# EAGLE design QL_keyboard (EAGLE 7.5.0)
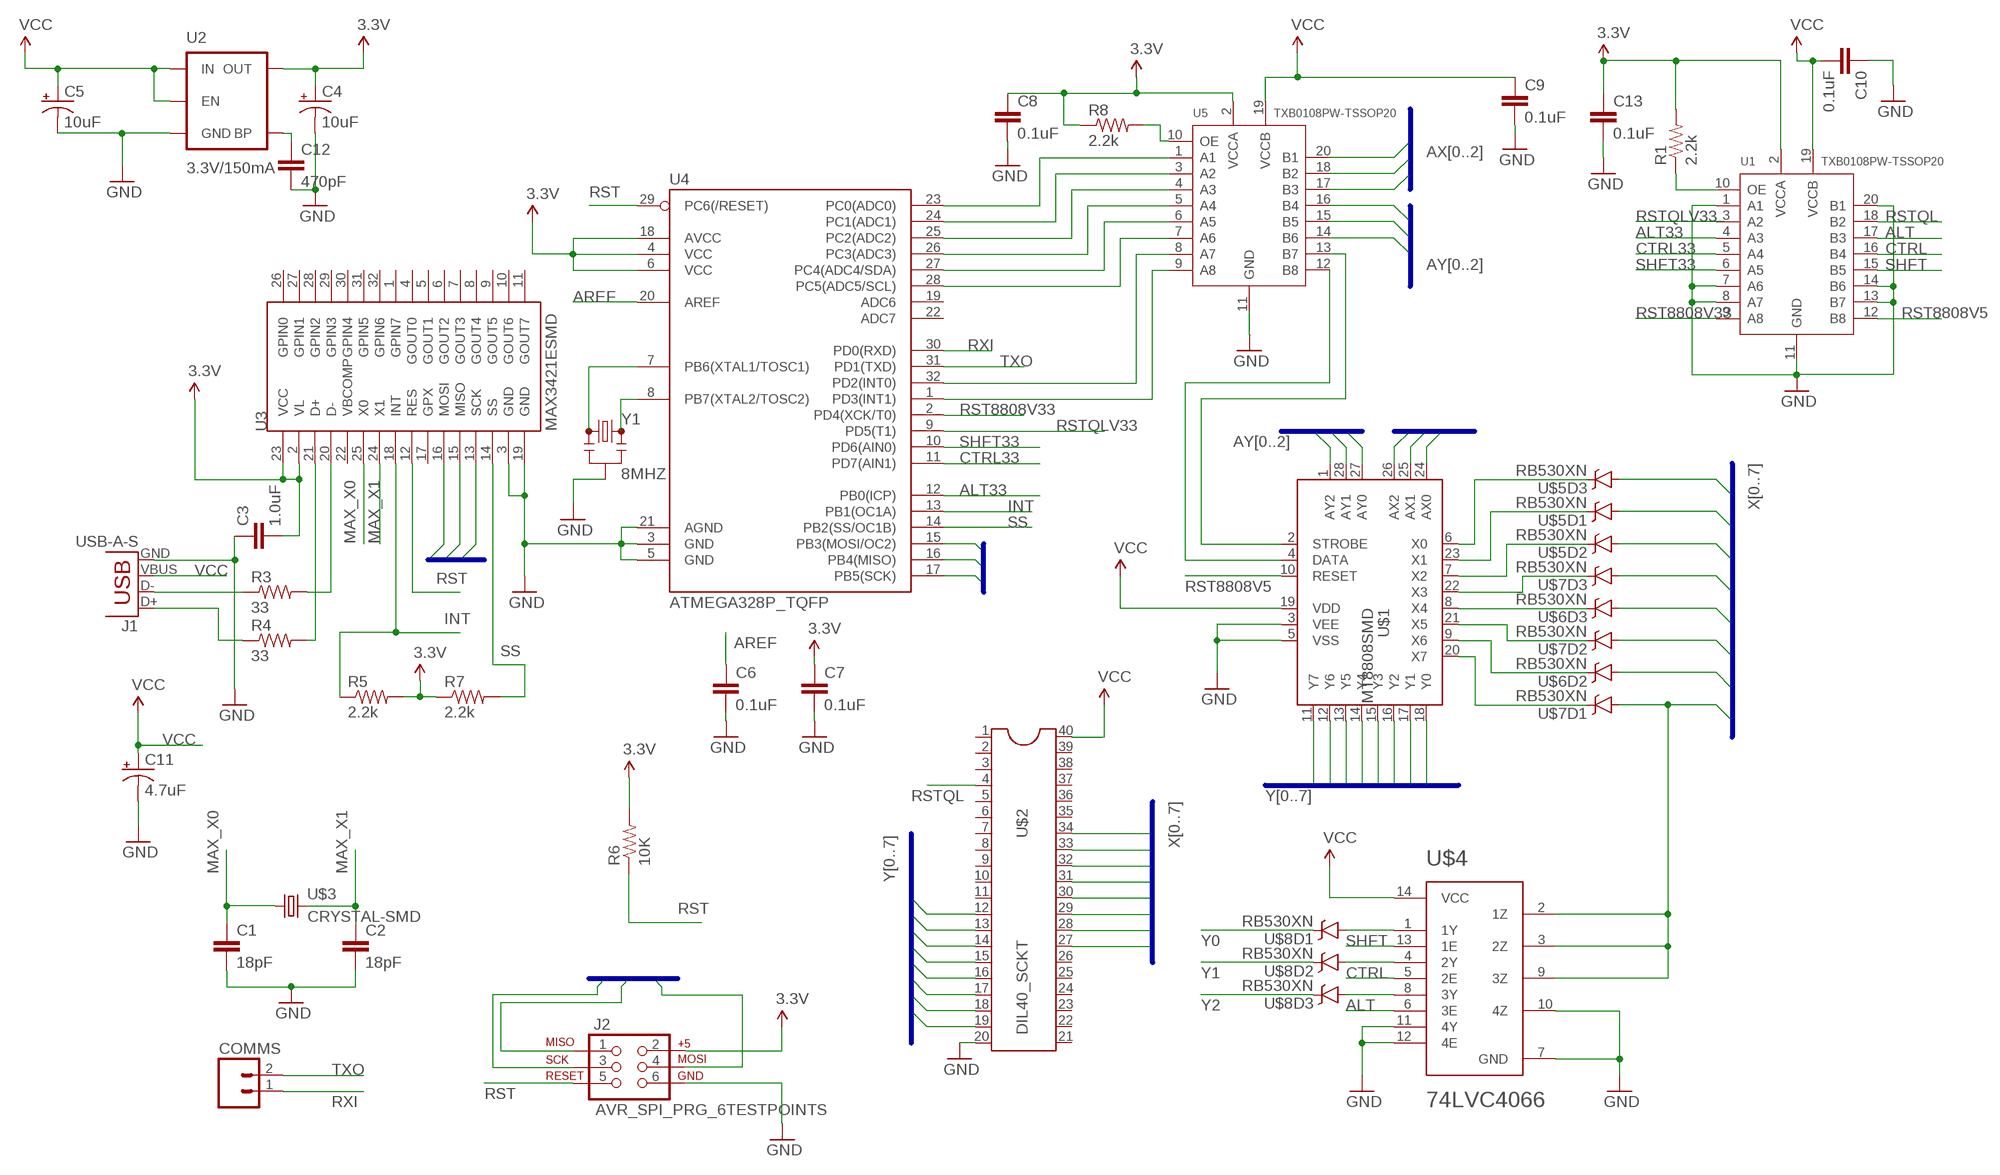
[diagram p0: schematic, sheet 1]

## Parts
C1  18pF  CAP0603-CAP  [0603-CAP]
C2  18pF  CAP0603-CAP  [0603-CAP]
C3  1.0uF  1.0UF-16V-10%(0603)  [0603-CAP]
C4  10uF  10UF-16V-10%(TANT)  [EIA3216]
C5  10uF  10UF-16V-10%(TANT)  [EIA3216]
C6  0.1uF  2.2UF-10V-20%(0603)  [0603-CAP]
C7  0.1uF  2.2UF-10V-20%(0603)  [0603-CAP]
C8  0.1uF  2.2UF-10V-20%(0603)  [0603-CAP]
C9  0.1uF  2.2UF-10V-20%(0603)  [0603-CAP]
C10  0.1uF  2.2UF-10V-20%(0603)  [0603-CAP]
C11  4.7uF  10UF-6.3V-20%(0603)(TANT)"  [0603-POL]
C12  470pF  2.2UF-10V-20%(0603)  [0603-CAP]
C13  0.1uF  2.2UF-10V-20%(0603)  [0603-CAP]
COMMS  M02PTH  [1X02]
J1  USB-A-S  [USB-A-S]
J2  AVR_SPI_PRG_6TESTPOINTS  [2X3_TEST_POINTS]
R1  2.2k  2.2KOHM-1/10W-1%(0603)  [0603-RES]
R3  33  33OHM1/10W1%(0603)  [0603-RES]
R4  33  33OHM1/10W1%(0603)  [0603-RES]
R5  2.2k  2.2KOHM-1/10W-1%(0603)  [0603-RES]
R6  10K  10KOHM-1/10W-1%(0603)0603  [0603-RES]
R7  2.2k  2.2KOHM-1/10W-1%(0603)  [0603-RES]
R8  2.2k  2.2KOHM-1/10W-1%(0603)  [0603-RES]
U1  TXB0108PW-TSSOP20  LOGIC-TXB0108PW(TSSOP20)  [TSSOP20-0.65-6.5X4.4MM]
U2  3.3V/150mA  V_REG_MIC52053.3V  [SOT23-5]
U3  MAX3421ESMD  [TQFP32-5MM]
U4  ATMEGA328P_TQFP  [TQFP32-08]
U5  TXB0108PW-TSSOP20  LOGIC-TXB0108PW(TSSOP20)  [TSSOP20-0.65-6.5X4.4MM]
U$1  MT8808SMD  [PLCC28S]
U$2  DIL40_SCKT  [DIL40]
U$3  CRYSTAL-SMD  [CRYSTAL-SMD-5X3.2]
U$4  74LVC4066  [TSSOP14]
U$5  RB530XN  [SOT363]
U$6  RB530XN  [SOT363]
U$7  RB530XN  [SOT363]
U$8  RB530XN  [SOT363]
Y1  8MHZ  RESONATOR8MHZ  [RESONATOR-SMD]

## Nets
3.3V: C3.2 C4.A(+) C7.1 C8.1 C13.1 J2.2 R1.2 R5.2 R6.2 R7.1 R8.1 U1.2(VCCA) U2.5(OUT) U3.2(VL) U3.23(VCC) U4.4(VCC) U4.6(VCC) U4.18(AVCC) U5.2(VCCA)
ALT: U1.17(B3) U$4.6(3E)
ALT33: U1.4(A3) U4.12(PB0(ICP))
AREF: C6.1 U4.20(AREF)
AX0: U5.20(B1) U$1.24(AX0)
AX1: U5.18(B2) U$1.25(AX1)
AX2: U5.17(B3) U$1.26(AX2)
AY0: U5.16(B4) U$1.27(AY0)
AY1: U5.15(B5) U$1.28(AY1)
AY2: U5.14(B6) U$1.1(AY2)
CTRL: U1.16(B4) U$4.5(2E)
CTRL33: U1.5(A4) U4.11(PD7(AIN1))
GND: C1.2 C2.2 C3.1 C4.C(-) C5.C(-) C6.2 C7.2 C8.2 C9.2 C10.1 C11.K(-) C12.2 C13.2 J1.GND J2.6 U1.1(A1) U1.7(A6) U1.8(A7) U1.11(GND) U1.13(B7) U1.14(B6) U1.20(B1) U2.2(GND) U3.3(GND) U3.19(GND) U4.3(GND) U4.5(GND) U4.21(AGND) U5.11(GND) U$1.3(VEE) U$1.5(VSS) U$2.20 U$4.7(GND) U$4.10(4Z) U$4.11(4Y) U$4.12(4E) Y1.2
INT: R5.1 U3.18(INT) U4.13(PB1(OC1A))
MAX_X0: C1.1 U3.25(X0) U$3.1
MAX_X1: C2.1 U3.24(X1) U$3.2
MISO: J2.1 U3.15(MISO) U4.16(PB4(MISO))
MOSI: J2.4 U3.16(MOSI) U4.15(PB3(MOSI/OC2))
N$1: J1.D- R3.1
N$2: R3.2 U3.20(D-)
N$3: R4.2 U3.21(D+)
N$4: J1.D+ R4.1
N$5: C12.1 U2.4(BP)
N$6: U4.23(PC0(ADC0)) U5.1(A1)
N$7: U4.24(PC1(ADC1)) U5.3(A2)
N$8: U4.25(PC2(ADC2)) U5.4(A3)
N$9: U4.26(PC3(ADC3)) U5.5(A4)
N$10: U4.27(PC4(ADC4/SDA)) U5.6(A5)
N$11: U4.28(PC5(ADC5/SCL)) U5.7(A6)
N$12: U4.32(PD2(INT0)) U5.8(A7)
N$13: U5.12(B8) U$1.4(DATA)
N$14: U5.13(B7) U$1.2(STROBE)
N$15: U4.8(PB7(XTAL2/TOSC2)) Y1.3
N$16: U4.7(PB6(XTAL1/TOSC1)) Y1.1
N$17: R8.2 U5.10(OE)
N$18: U4.1(PD3(INT1)) U5.9(A8)
N$19: U$1.6(X0) U$5.3(D3:C)
N$20: U$1.23(X1) U$5.1(D1:C)
N$21: U$1.7(X2) U$5.2(D2:C)
N$22: U$1.22(X3) U$7.3(D3:C)
N$23: U$1.8(X4) U$6.3(D3:C)
N$24: U$1.21(X5) U$7.2(D2:C)
N$25: U$1.9(X6) U$6.2(D2:C)
N$26: U$1.20(X7) U$7.1(D1:C)
N$27: U$4.1(1Y) U$8.6(D1:A)
N$28: U$4.4(2Y) U$8.5(D2:A)
N$29: U$4.8(3Y) U$8.4(D3:A)
N$31: R1.1 U1.10(OE)
RST: J2.5 R6.1 U3.12(RES) U4.29(PC6(/RESET))
RST8808V5: U1.12(B8) U$1.10(RESET)
RST8808V33: U1.9(A8) U4.2(PD4(XCK/T0))
RSTQL: U1.18(B2) U$2.4
RSTQLV33: U4.9(PD5(T1))
RXI: COMMS.1 U4.30(PD0(RXD))
SCK: J2.3 U3.13(SCK) U4.17(PB5(SCK))
SHFT: U1.15(B5) U$4.13(1E)
SHFT33: U1.6(A5) U4.10(PD6(AIN0))
SS: R7.2 U3.14(SS) U4.14(PB2(SS/OC1B))
TXO: COMMS.2 U4.31(PD1(TXD))
VCC: C5.A(+) C9.1 C10.2 C11.A(+) J1.VBUS U1.19(VCCB) U2.1(IN) U2.3(EN) U5.19(VCCB) U$1.19(VDD) U$2.40 U$4.14(VCC)
X0: U$2.27 U$5.4(D3:A)
X1: U$2.28 U$5.6(D1:A)
X2: U$2.29 U$5.5(D2:A)
X3: U$2.30 U$7.4(D3:A)
X4: U$2.31 U$6.4(D3:A)
X5: U$2.32 U$7.5(D2:A)
X6: U$2.33 U$6.5(D2:A)
X7: U$2.34 U$4.2(1Z) U$4.3(2Z) U$4.9(3Z) U$7.6(D1:A)
Y0: U$1.18(Y0) U$2.12 U$8.1(D1:C)
Y1: U$1.17(Y1) U$2.13 U$8.2(D2:C)
Y2: U$1.16(Y2) U$2.14 U$8.3(D3:C)
Y3: U$1.15(Y3) U$2.15
Y4: U$1.14(Y4) U$2.16
Y5: U$1.13(Y5) U$2.17
Y6: U$1.12(Y6) U$2.18
Y7: U$1.11(Y7) U$2.19
Unconnected: U1.3(A2) U3.1(GPIN7) U3.4(GOUT0) U3.5(GOUT1) U3.6(GOUT2) U3.7(GOUT3) U3.8(GOUT4) U3.9(GOUT5) U3.10(GOUT6) U3.11(GOUT7) U3.17(GPX) U3.22(VBCOMP) U3.26(GPIN0) U3.27(GPIN1) U3.28(GPIN2) U3.29(GPIN3) U3.30(GPIN4) U3.31(GPIN5) U3.32(GPIN6) U4.19(ADC6) U4.22(ADC7) U$2.1 U$2.2 U$2.3 U$2.5 U$2.6 U$2.7 U$2.8 U$2.9 U$2.10 U$2.11 U$2.21 U$2.22 U$2.23 U$2.24 U$2.25 U$2.26 U$2.35 U$2.36 U$2.37 U$2.38 U$2.39 U$6.1(D1:C) U$6.6(D1:A)

## Buses
Y[0..7]
X[0..7]
AX[0..2]
AY[0..2]
MOSI,MISO,SCK

## Library data of the parts
C1 C2 = SparkFun-Passives:CAP: Capacitor Standard 0603 ceramic capacitor, and 0.1" leaded capacitor.
C3 = SparkFun-Capacitors:1.0UF-16V-10%(0603): CAP-00868; PROD_ID: CAP-00868
C4 C5 = SparkFun-Capacitors:10UF-16V-10%(TANT): CAP-00811 1206/EIA-3216 Tantalum capacitor; PROD_ID: CAP-00811
C6-C10 C12 C13 = SparkFun-Capacitors:2.2UF-10V-20%(0603): CAP-07888; PROD_ID: CAP-07888; VALUE: 2.2uF
C11 = SparkFun-Capacitors:10UF-6.3V-20%(0603)(TANT); PROD_ID: CAP-13210; VALUE: 10uF
COMMS = ppe_custom:M02: Standard 2-pin 0.1" header. Use with - straight break away headers ( PRT-00116) - right angle break away headers (PRT-00553) - swiss pins (PRT-00743) - machine pins (PRT-00117) - female headers (PRT-00115) Molex polarized connector foot print use with: PRT-08233 with associated crimp pins and housings. 2.54_SCREWTERM for use with PRT-10571. 3.5mm Screw Terminal footprints for PRT-08084 5mm Screw Terminal footprints for use with PRT-08432
J1 = ppe_custom:USB: USB Connectors USB-B-PTH is fully proven SKU : PRT-00139/CONN-08278 USB-miniB is fully proven SKU : PRT-00587 USB-A-PCB is untested. USB-A-H is throughly reviewed, but untested. Spark Fun Electronics SKU : PRT-00437 USB-B-SMT is throughly reviewed, but untested. Needs silkscreen touching up. USB-A-S has not been used/tested USB-MB-H has not been used/tested USB-MICROB has been used. CONN-09505
J2 = SparkFun-Connectors:AVR_SPI_PRG_6: AVR ISP 6 Pin This is the reduced ISP connector for AVR programming. Common on Arduino. This footprint will take up less PCB space and can be used with a 10-pin to 6-pin adapter such as SKU: BOB-08508 **Special note about "TEST_POINT" package. The stop mask is on the top side, so if you want your programming test points to be on the bottom of your board, make sure to place this package on the bottom side of the board. This also ensure that the orientation to program from the bottom side will be correct.
R1 R5 R7 R8 = SparkFun-Resistors:2.2KOHM-1/10W-1%(0603): RES-08272; PROD_ID: RES-08272
R3 R4 = SparkFun-Resistors:33OHM1/10W1%(0603): RES-08270; PROD_ID: RES-08270
R6 = SparkFun-Resistors:10KOHM-1/10W-1%(0603): RES-00824; PROD_ID: RES-00824
U1 U5 = Seeed-OPL-ic:LOGIC-TXB0108PW(TSSOP20): 310050024; MPN: TXB0108PW
U2 = SparkFun-PowerIC:V_REG_MIC5205: V_REG MIC5205 Standard 3.3V, 5V, and Adjustable 150mA LDO voltage regulator in SOT-23 layout. Micrel part MIC5205. BP (by-pass) pin is used to lower output noise with 470pF cap, may be left open. On the adjustable version BP is used to set output.; PROD_ID: VREG-00822
U3 = SparkFun-DigitalIC:MAX3421E: USB Peripheral/Host Controller w/ SPI
U4 = SparkFun-DigitalIC:ATMEGA328P_TQFP; PROD_ID: IC-09069
U$1 = ppe_custom:MT8808
U$2 = ppe_custom:DIL40_SCKT
U$3 = ppe_custom:CRYSTAL-SMD: CTS Model 445 SMD Quartz DS http://www.mouser.com/ds/2/96/008-0360-0-786290.pdf
U$4 = ppe_custom:74LVC4066: Quad bilateral switch - The 74LVC4066 provides four single pole, single-throw analog switch functions.
U$5-U$8 = ppe_custom:RB530XN: Triple Schottky Barrier Diode
Y1 = ppe_custom:RESONATOR: Resonator Small SMD resonator. Used, eg, on the Arduino Pro/ Pro Mini boards. 8MHz- XTAL-08895 16MHz- XTAL-08900; PROD_ID: XTAL-08895

## Board
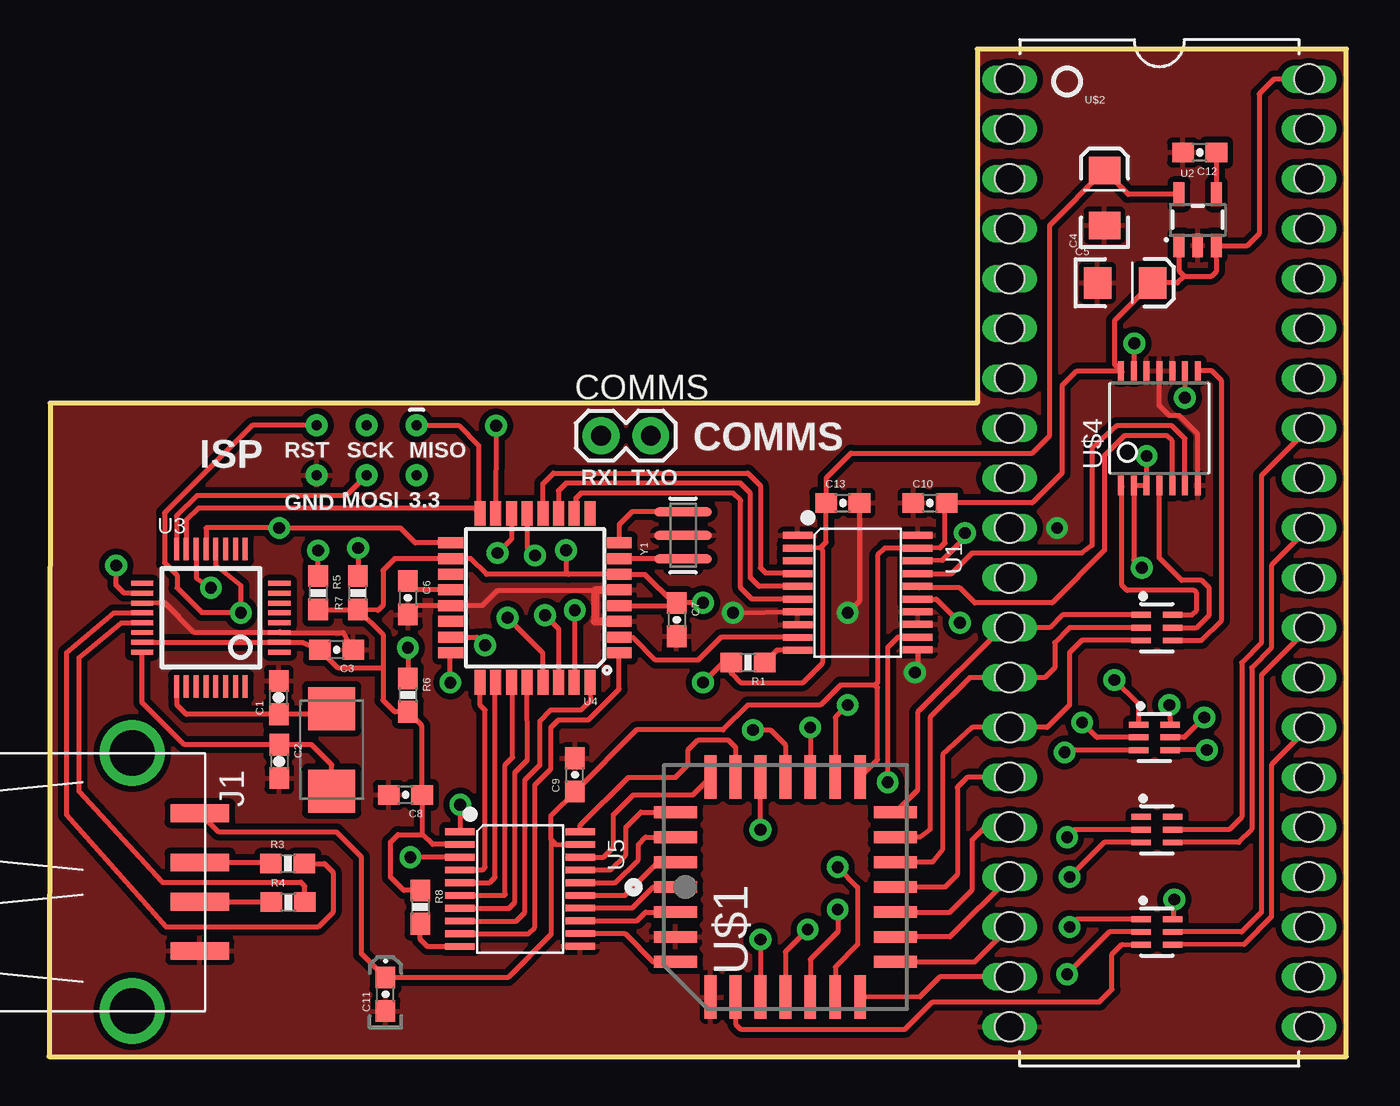
[diagram p1: board, top side]
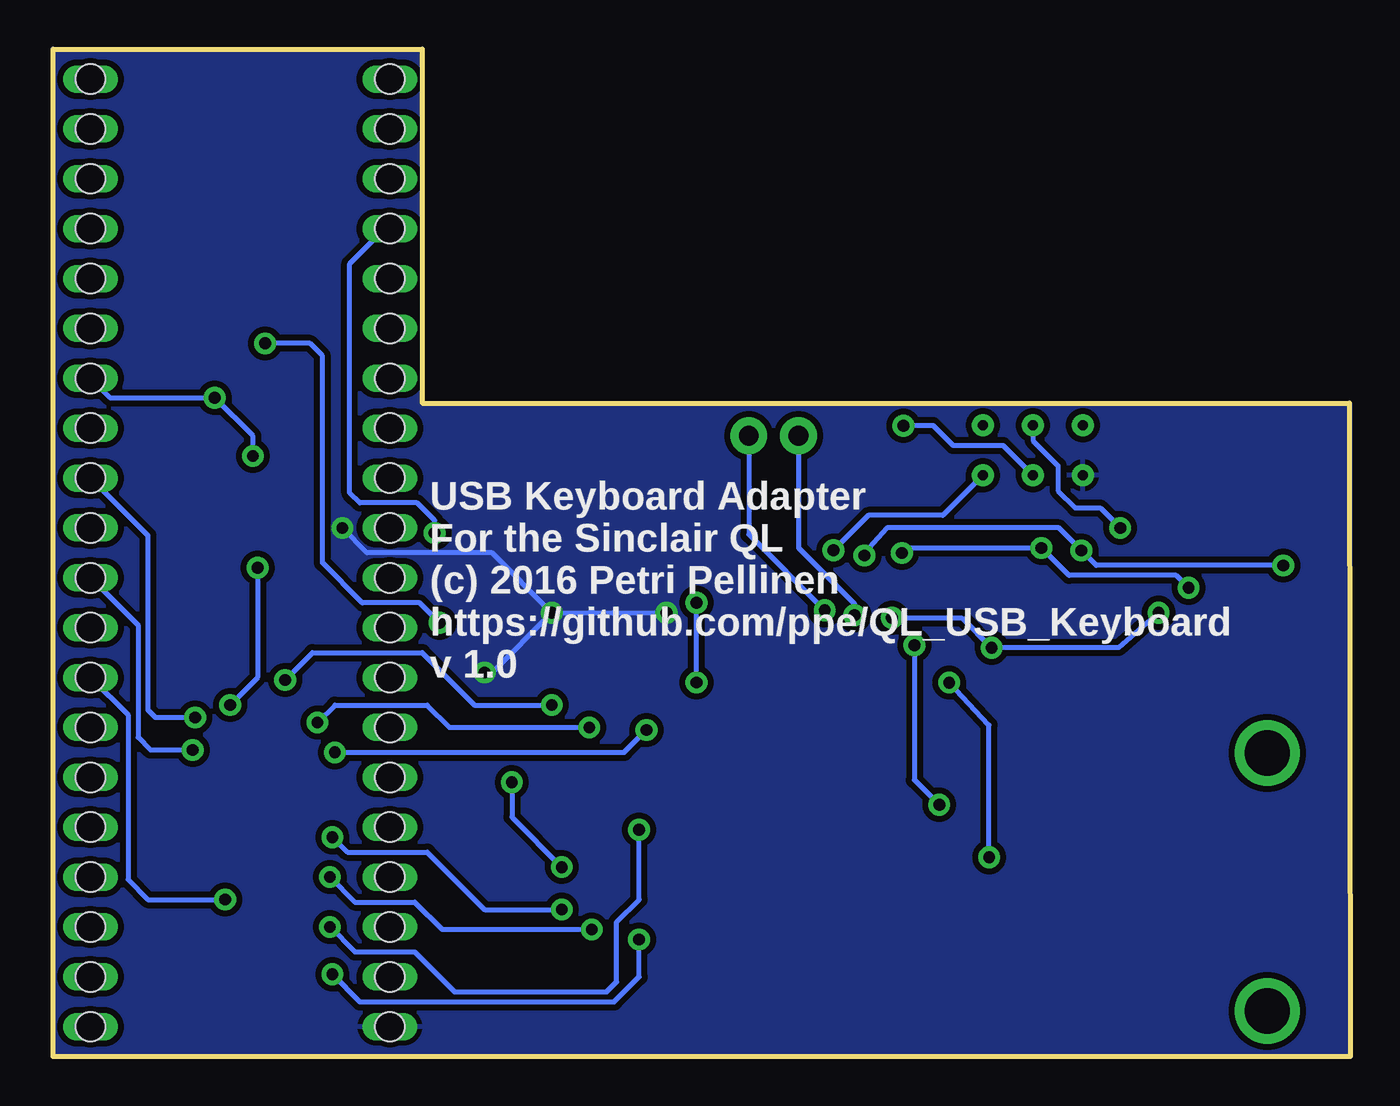
[diagram p2: board, bottom side, seen from below]

Size 66.08 x 51.31 mm. Coordinates in mm from the lower left corner, seen from the top.
Copper layers (1*16): Top 0.035mm / dielectric 1.5mm / Bottom 0.035mm
Design rules "SeeedStudio_2layer_DRU_no_angle_20140221 *": minimum track width 10mil, minimum drill 12mil, track to track 8mil, track to pad 8mil, pad to pad 8mil, via to via 10mil, smd to smd 0mil, copper to edge 10mil, drill to drill 10mil, minimum pad ring 12mil, minimum via ring 10mil, stop-mask expansion 2mil, vias tented up to drill 100mil, thermal gap 10mil
Milling: area 0,0 to 66.1,51.3

### Footprints (pad centres in the part's own frame; a part is rotated, then mirrored left to right if it is on the bottom)
0603-CAP = smd 1.1 x 1: 1 -0.85,0; 2 0.85,0
EIA3216 = smd 1.4 x 1.6: A 1.4,0; C -1.4,0
0603-POL = smd 1.1 x 1: A 0.85,0; K -0.85,0
1X02 = drill 1.016 pad 1.88: 1 0,0; 2 2.54,0
USB-A-S = smd 3 x 0.9: D+ 3.45,-1; D- 3.45,1; GND 3.45,-3.508; VBUS 3.45,3.508 | drill 2.311: P$5 0,-6.566; P$6 0,6.566
2X3_TEST_POINTS = drill 0.508: 1 -2.54,-1.27; 2 -2.54,1.27; 3 0,-1.27; 4 0,1.27; 5 2.54,-1.27; 6 2.54,1.27
0603-RES = smd 1.1 x 1: 1 -0.85,0; 2 0.85,0
TSSOP20-0.65-6.5X4.4MM = smd 0.35 x 1.5: 1 -2.925,-3.065; 2 -2.275,-3.065; 3 -1.625,-3.065; 4 -0.975,-3.065; 5 -0.325,-3.065; 6 0.325,-3.065; 7 0.975,-3.065; 8 1.625,-3.065; 9 2.275,-3.065; 10 2.925,-3.065; 11 2.91,3.065; 12 2.26,3.065; 13 1.61,3.065; 14 0.96,3.065; 15 0.325,3.065; 16 -0.325,3.065; 17 -0.975,3.065; 18 -1.625,3.065; 19 -2.275,3.065; 20 -2.925,3.065
SOT23-5 = smd 0.55 x 1.2: 1 -0.95,-1.3; 2 0,-1.3; 3 0.95,-1.3; 4 0.95,1.3; 5 -0.95,1.3
TQFP32-5MM = smd 1.143 x 0.254: 1 -3.5,1.75; 2 -3.5,1.25; 3 -3.5,0.75; 4 -3.5,0.25; 5 -3.5,-0.25; 6 -3.5,-0.75; 7 -3.5,-1.25; 8 -3.5,-1.75; 17 3.5,-1.75; 18 3.5,-1.25; 19 3.5,-0.75; 20 3.5,-0.25; 21 3.5,0.25; 22 3.5,0.75; 23 3.5,1.25; 24 3.5,1.75 | smd 0.254 x 1.143: 9 -1.75,-3.5; 10 -1.25,-3.5; 11 -0.75,-3.5; 12 -0.25,-3.5; 13 0.25,-3.5; 14 0.75,-3.5; 15 1.25,-3.5; 16 1.75,-3.5; 25 1.75,3.5; 26 1.25,3.5; 27 0.75,3.5; 28 0.25,3.5; 29 -0.25,3.5; 30 -0.75,3.5; 31 -1.25,3.5; 32 -1.75,3.5
TQFP32-08 = smd 1.27 x 0.559: 1 -4.293,2.8; 2 -4.293,2; 3 -4.293,1.2; 4 -4.293,0.4; 5 -4.293,-0.4; 6 -4.293,-1.2; 7 -4.293,-2; 8 -4.293,-2.8; 17 4.293,-2.8; 18 4.293,-2; 19 4.293,-1.2; 20 4.293,-0.4; 21 4.293,0.4; 22 4.293,1.2; 23 4.293,2; 24 4.293,2.8 | smd 0.559 x 1.27: 9 -2.8,-4.293; 10 -2,-4.293; 11 -1.2,-4.293; 12 -0.4,-4.293; 13 0.4,-4.293; 14 1.2,-4.293; 15 2,-4.293; 16 2.8,-4.293; 25 2.8,4.293; 26 2,4.293; 27 1.2,4.293; 28 0.4,4.293; 29 -0.4,4.293; 30 -1.2,4.293; 31 -2,4.293; 32 -2.8,4.293
PLCC28S = smd 0.6 x 2.2: 1 0,5.6; 2 -1.27,5.6; 3 -2.54,5.6; 4 -3.81,5.6; 12 -3.81,-5.6; 13 -2.54,-5.6; 14 -1.27,-5.6; 15 0,-5.6; 16 1.27,-5.6; 17 2.54,-5.6; 18 3.81,-5.6; 26 3.81,5.6; 27 2.54,5.6; 28 1.27,5.6 | smd 2.2 x 0.6: 5 -5.6,3.81; 6 -5.6,2.54; 7 -5.6,1.27; 8 -5.6,0; 9 -5.6,-1.27; 10 -5.6,-2.54; 11 -5.6,-3.81; 19 5.6,-3.81; 20 5.6,-2.54; 21 5.6,-1.27; 22 5.6,0; 23 5.6,1.27; 24 5.6,2.54; 25 5.6,3.81
DIL40 = drill 0.8 long: 1 -24.13,-7.62; 2 -21.59,-7.62; 3 -19.05,-7.62; 4 -16.51,-7.62; 5 -13.97,-7.62; 6 -11.43,-7.62; 7 -8.89,-7.62; 8 -6.35,-7.62; 9 -3.81,-7.62; 10 -1.27,-7.62; 11 1.27,-7.62; 12 3.81,-7.62; 13 6.35,-7.62; 14 8.89,-7.62; 15 11.43,-7.62; 16 13.97,-7.62; 17 16.51,-7.62; 18 19.05,-7.62; 19 21.59,-7.62; 20 24.13,-7.62; 21 24.13,7.62; 22 21.59,7.62; 23 19.05,7.62; 24 16.51,7.62; 25 13.97,7.62; 26 11.43,7.62; 27 8.89,7.62; 28 6.35,7.62; 29 3.81,7.62; 30 1.27,7.62; 31 -1.27,7.62; 32 -3.81,7.62; 33 -6.35,7.62; 34 -8.89,7.62; 35 -11.43,7.62; 36 -13.97,7.62; 37 -16.51,7.62; 38 -19.05,7.62; 39 -21.59,7.62; 40 -24.13,7.62 | hole 1.5: -24.13,-7.62; -21.59,-7.62; -19.05,-7.62; -16.51,-7.62; -13.97,-7.62; -11.43,-7.62; -8.89,-7.62; -6.35,-7.62; -3.81,-7.62; -1.27,-7.62; 1.27,-7.62; 3.81,-7.62; 6.35,-7.62; 8.89,-7.62; 11.43,-7.62; 13.97,-7.62; 16.51,-7.62; 19.05,-7.62; 21.59,-7.62; 24.13,-7.62; 24.13,7.62; 21.59,7.62; 19.05,7.62; 16.51,7.62; 13.97,7.62; 11.43,7.62; 8.89,7.62; 6.35,7.62; 3.81,7.62; 1.27,7.62; -1.27,7.62; -3.81,7.62; -6.35,7.62; -8.89,7.62; -11.43,7.62; -13.97,7.62; -16.51,7.62; -19.05,7.62; -21.59,7.62; -24.13,7.62
CRYSTAL-SMD-5X3.2 = smd 2.2 x 2.4: 1 -2.1,0; 2 2.1,0
TSSOP14 = smd 0.305 x 0.991: 1 -1.95,-2.918; 2 -1.3,-2.918; 3 -0.65,-2.918; 4 0,-2.918; 5 0.65,-2.918; 6 1.3,-2.918; 7 1.95,-2.918; 8 1.95,2.918; 9 1.3,2.918; 10 0.65,2.918; 11 0,2.918; 12 -0.65,2.918; 13 -1.3,2.918; 14 -1.95,2.918
SOT363 = smd 0.3 x 0.99: 1 -0.65,-0.8; 2 0,-0.8; 3 0.65,-0.8; 4 0.65,0.81; 5 0,0.81; 6 -0.65,0.81
RESONATOR-SMD = smd 0.45 x 2.921: 1 -1.2,0; 2 0,0; 3 1.2,0

### Placement (x,y rotation side)
C1  11.7,18.29 90 top
C2  11.72,15.03 270 top
C3  14.64,20.72 180 top
C4  53.76,43.73 90 top
C5  54.8,39.41 0 top
C6  18.28,23.36 270 top
C7  31.97,22.26 270 top
C8  18.15,13.33 180 top
C9  26.79,14.35 90 top
C10  44.87,28.19 0 top
C11  17.13,3.17 90 top
C12  58.61,46.04 180 top
C13  40.43,28.19 0 top
COMMS  28.11,31.62 0 top
J1  4.23,8.89 0 top
J2  16.18,30.88 180 top
R1  35.6,20.07 180 top
R3  12.16,9.83 0 top
R4  12.18,7.87 0 top
R5  13.7,23.62 270 top
R6  18.28,18.41 270 top
R7  15.74,23.62 90 top
R8  18.91,7.62 270 top
U1  41.19,23.62 270 top
U2  58.51,42.62 0 top
U3  8.24,22.35 180 top
U4  24.75,23.36 180 top
U5  23.99,8.53 270 top
U$1  37.51,8.64 90 top
U$2  56.56,25.65 270 top
U$3  14.39,15.62 270 top
U$4  56.56,32 0 top
U$5  56.43,6.35 270 top
U$6  56.43,11.56 270 top
U$7  56.3,16.26 270 top
U$8  56.43,21.84 270 top
Y1  32.3,26.54 90 top

### Tracks (layer width: path | path; a pad name or v marks a point on that pad's centre or on a via)
3.3V  (via drill 0.6)
  Top 0.254: U3.23 U3.2 12.91,21.1 C3.2 14.71,19.81 17.01,19.81 | 26.46,24.57 U4.6 30.34,24.57 31.8,23.11 C7.1 | 26.46,24.57 22.28,24.57 21.48,25.36 U4.18 17.61,25.36 17.01,24.76 17.01,22.98 16.75,22.73 R7.1 | R7.1 17.01,21.5 17.01,19.81 | 17.01,19.81 17.01,18.16 17.6,17.56 R6.2 19,16.84 C8.1 19.04,13.29 19.04,11.3 | R5.2 R7.1 | U5.2 19.53,10.81 19.04,11.3 | R8.1 18.06,8.47 17.39,9.14 17.39,10.92 17.77,11.3 19.04,11.3 | U4.4 31.83,22.96 C7.1 | v26.33,25.78 26.33,24.69 26.46,24.57 | 39.29,25.91 39.58,26.2 C13.1 39.58,29.46 40.85,30.73 50.08,30.73 50.97,31.62 50.97,42.33 C4.A 54.98,43.91 U2.5 | 39.29,25.91 U1.2 | 39.29,25.91 39.41,25.78 39.41,20.07 38.4,19.05 35.22,19.05 34.75,19.52 R1.2 34.33,20.07 v33.32,19.05 | v33.32,23.11 C7.1
  Bottom 0.254: J2.2 20.76,27.56 24.55,27.56 v26.33,25.78 | v33.32,19.05 v33.32,23.11
ALT
  Top 0.254: U1.17 45.98,24.6 47.03,25.65 52.62,25.65 53.13,26.04 53.13,30.99 54.4,32.13 57.19,32.13 57.86,31.47 U$4.6
ALT33
  Top 0.254: U4.12 25.15,29.18 25.7,29.72 35.6,29.72 36.24,29.08 36.24,24.89 36.49,24.64 38.08,24.64 U1.4
AREF
  Top 0.254: U4.20 18.73,23.77 C6.1
AX0
  Top 0.254: U5.20 27.06,11.77 29.51,14.22 31.92,14.22 32.55,14.86 32.55,15.62 33.06,16.13 34.59,16.13 34.97,15.75 U$1.24
AX1
  Top 0.254: U5.18 28.23,10.16 28.75,10.67 28.75,12.32 29.76,13.34 32.8,13.34 U$1.25
AX2
  Top 0.254: U5.17 28.6,9.51 29.38,10.29 29.38,11.68 30.14,12.45 U$1.26
AY0
  Top 0.254: U5.16 28.84,8.86 30.01,10.03 30.01,10.79 30.4,11.18 U$1.27
AY1
  Top 0.254: U5.15 29.33,8.21 31.03,9.91 U$1.28
AY2
  Top 0.254: U5.14 29.71,7.57 30.78,8.64 U$1.1
CTRL
  Top 0.254: U$4.5 57.21,31.35 56.94,31.62 54.78,31.62 53.76,30.61 53.76,25.78 51.1,23.11 47.16,23.11 46.4,23.88 44.33,23.88 U1.16
CTRL33
  Top 0.254: U1.5 36.17,23.95 35.73,24.38 35.73,28.7 35.22,29.21 26.33,29.21 25.95,28.83 U4.11
GND  (via drill 0.6)
  Top 0.254: 11.75,21.64 U3.3 | 20.46,22.98 22.09,22.98 22.85,23.75 27.8,23.75 | U3.3 14.99,21.6 C3.1 | U4.21 18.73,22.96 C6.2 | U3.3 7.4,21.6 5.88,23.11 U3.19 | C13.2 41.28,23.2 v40.68,22.61 | v34.84,22.61 U1.7 | U1.11 44.26,19.7 v44.11,19.56 | U$4.7 58.51,31.7 57.57,32.64 57.07,32.64 56.56,33.15 U$4.11
  Top 0.406: U4.5 29.05,23.75 27.8,23.75 27.8,22.16 U4.3 | U4.21 20.46,22.98
  Bottom 0.254: v40.68,22.61 v34.84,22.61 | v44.11,19.56 43.73,19.56 v40.68,22.61 | v40.68,22.61 43.73,25.65 50.08,25.65 v51.35,26.92
  pour Top (isolate 0.305): 0,0 66.08,0 66.08,51.31 47.29,51.31 47.29,33.27 0.05,33.27
  pour Bottom (isolate 0.305): 0.04,0 66.08,0 66.08,51.31 47.29,51.31 47.29,33.27 0.04,33.27
INT  (via drill 0.6)
  Top 0.254: U4.13 24.35,25.92 v24.75,25.52 | R5.1 v13.7,25.78 | U3.18 3.82,23.6 3.42,24 v3.42,25.02
  Bottom 0.254: v24.75,25.52 24.75,25.65 23.61,26.92 14.85,26.92 v13.7,25.78 12.94,25.02 v3.42,25.02
MAX_X0
  Top 0.254: U$3.1 14.11,17.43 C1.1 6.99,17.43 6.52,17.91 6.52,18.82 U3.25
MAX_X1
  Top 0.254: 4.95,20.6 U3.24 4.74,18.03 6.89,15.88 C2.1 13.37,15.88 14.39,14.86 U$3.2
MISO
  Top 0.254: U3.15 6.99,27.32 7.61,27.94 21.68,27.94 U4.16 21.89,27.73 21.89,31.11 20.86,32.15 J2.1
MOSI  (via drill 0.6)
  Top 0.254: J2.4 15.14,28.57 7.54,28.57 6.49,27.53 U3.16 | 22.78,27.68 U4.15 v22.78,32.13
  Bottom 0.254: J2.4 17.68,31.11 20.24,31.11 21.25,32.13 v22.78,32.13
N$1
  Top 0.254: J1.D- 11.24,9.89 R3.1
N$2
  Top 0.254: R3.2 14.04,9.83 14.47,9.39 14.47,7.36 13.7,6.6 5.96,6.6 0.88,12.32 0.88,20.57 3.29,22.6 U3.20
N$3
  Top 0.254: R4.2 13.03,8.67 12.82,8.89 5.76,8.89 1.51,13.51 1.51,20.32 3.67,22.09 U3.21
N$4
  Top 0.254: J1.D+ 11.33,7.89 R4.1
N$5
  Top 0.254: C12.1 U2.4
N$6  (via drill 0.6)
  Top 0.254: U4.23 21.8,21.36 v22.21,20.95 | v20.94,12.82 20.94,11.47 U5.1
  Bottom 0.254: v22.21,20.95 22.21,14.09 v20.94,12.82
N$7  (via drill 0.6)
  Top 0.254: U5.3 19.55,10.16 v18.4,10.16 | v20.44,19.05 20.44,20.54 U4.24
  Bottom 0.254: v18.4,10.16 18.4,16.89 v20.44,19.05
N$8
  Top 0.254: U5.4 22.07,9.51 22.21,9.65 22.21,17.65 21.96,17.9 U4.25
N$9
  Top 0.254: U5.5 22.44,8.86 22.72,9.14 22.72,19.04 U4.26
N$10
  Top 0.254: U5.6 23.18,8.21 23.23,8.25 23.23,14.86 23.61,15.24 23.61,19.02 U4.27
N$11
  Top 0.254: U5.7 23.42,7.56 23.74,7.87 23.74,14.47 24.37,15.11 U4.28
N$12
  Top 0.254: U5.8 23.79,6.91 24.25,7.36 24.25,14.09 25.01,14.86 25.01,17.09 25.57,17.65 27.09,17.65 27.6,18.16 U4.32
N$13
  Top 0.254: U5.12 29.33,6.27 30.78,4.83 U$1.4
N$14
  Top 0.254: U5.13 29.95,6.92 30.4,7.37 U$1.2
N$15
  Top 0.254: Y1.3 29.69,27.74 29.05,27.1 U4.8
N$16
  Top 0.254: Y1.1 32.28,25.36 U4.7
N$17
  Top 0.254: U5.10 19.27,5.61 18.91,5.97 R8.2
N$18
  Top 0.254: U5.9 24.41,6.26 24.75,6.6 24.75,13.84 25.57,14.66 25.57,16.76 25.95,17.14 27.47,17.14 29.05,18.72 U4.1
N$19
  Top 0.254: U$5.3 54.65,5.71 54.14,5.21 54.14,3.43 53.51,2.79 47.54,2.79 47.16,2.79 45,2.79 43.6,1.4 35.22,1.4 34.97,1.65 U$1.6
N$20  (via drill 0.6)
  Top 0.254: U$5.1 52.38,7 v51.99,6.6 | v36.24,11.56 U$1.23
  Bottom 0.254: v51.99,6.6 50.72,5.33 47.67,5.33 45.64,3.3 37.89,3.3 37.38,3.81 37.38,6.86 36.24,8 v36.24,11.56
N$21  (via drill 0.6)
  Top 0.254: U$5.2 54.02,6.35 v51.86,4.19 | v36.24,5.97 U$1.7
  Bottom 0.254: v51.86,4.19 50.46,2.79 37.51,2.79 36.24,4.06 v36.24,5.97
N$22  (via drill 0.6)
  Top 0.254: U$7.3 51.84,15.61 v51.73,15.49 | v35.86,16.64 36.75,16.64 37.51,15.88 U$1.22
  Bottom 0.254: v51.73,15.49 37,15.49 v35.86,16.64
N$23  (via drill 0.6)
  Top 0.254: U$6.3 53.75,10.91 v51.99,9.14 | v38.65,6.48 37.51,5.33 U$1.8
  Bottom 0.254: v51.99,9.14 50.72,7.87 47.67,7.87 46.27,6.48 v38.65,6.48
N$24  (via drill 0.6)
  Top 0.254: U$7.2 53.38,16.26 v52.62,17.02 | v38.78,16.76 U$1.21
  Bottom 0.254: v52.62,17.02 51.73,17.91 47.03,17.91 45.89,16.76 v38.78,16.76
N$25  (via drill 0.6)
  Top 0.254: U$6.2 52.24,11.56 v51.86,11.18 | v40.17,7.49 40.17,6.35 38.78,4.95 U$1.9
  Bottom 0.254: v51.86,11.18 51.1,10.41 47.03,10.41 44.11,7.49 v40.17,7.49
N$26  (via drill 0.6)
  Top 0.254: U$7.1 55.5,17.95 v54.27,19.18 | v40.68,17.91 40.05,17.27 U$1.20
  Bottom 0.254: v54.27,19.18 52.88,20.57 47.29,20.57 44.62,17.91 v40.68,17.91
N$27
  Top 0.254: U$8.6 58.22,22.49 58.46,22.73 58.46,23.62 58.34,23.75 54.91,23.75 54.65,24 54.65,29.04 U$4.1
N$28
  Top 0.254: U$8.5 58.46,21.84 59.1,22.48 59.1,23.88 58.72,24.26 57.7,24.26 56.56,25.4 U$4.4
N$29
  Top 0.254: U$8.4 58.7,21.19 59.73,22.23 59.73,34.42 59.23,34.92 U$4.8
N$31
  Top 0.254: U1.10 37.08,20.7 R1.1
RST  (via drill 0.6)
  Top 0.254: U4.29 25.15,20.55 v23.36,22.35 | v18.28,20.82 R6.1 | U3.12 8.49,25.02 9.77,24 v9.77,22.6 7.79,22.61 6.52,23.88 6.52,24.51 5.88,25.15 5.88,27.69 10.35,32.15 J2.5
  Bottom 0.254: v23.36,22.35 19.8,22.35 v18.28,20.82 11.8,20.82 v9.77,22.6
RST8808V5  (via drill 0.6)
  Top 0.254: v40.17,9.65 41.19,8.64 41.19,5.71 40.05,4.57 U$1.10 | U1.12 43.25,21.36 42.72,20.83 v42.72,13.97
  Bottom 0.254: v42.72,13.97 42.72,12.19 v40.17,9.65
RST8808V33
  Top 0.254: U1.9 34.22,21.35 33.06,20.19 30.9,20.19 29.76,21.34 29.08,21.34 U4.2
RSTQL  (via drill 0.6)
  Top 0.254: v46.65,26.67 46.65,26.42 45.51,25.27 U1.18
  Bottom 0.254: U$2.4 49.19,42.16 50.97,40.39 50.97,28.7 50.46,28.19 47.54,28.19 46.65,27.3 v46.65,26.67
RXI  (via drill 0.6)
  Top 0.254: v25.26,22.48 25.95,21.78 U4.30
  Bottom 0.254: COMMS.1 28.11,25.91 25.26,23.06 v25.26,22.48
SCK  (via drill 0.6)
  Top 0.254: U4.17 18.65,26.16 17.89,26.92 v11.73,26.92 7.99,26.92 U3.13
  Bottom 0.254: J2.3 16.18,31.37 14.9,30.1 14.9,28.83 14.01,27.94 12.74,27.94 v11.73,26.92
SHFT  (via drill 0.6)
  Top 0.254: U1.15 45.2,23.3 v46.4,22.1 | U$4.13 55.29,34.95 v55.29,36.32
  Bottom 0.254: v46.4,22.1 47.41,23.11 50.34,23.11 52.37,25.15 52.37,35.69 53,36.32 v55.29,36.32
SHFT33
  Top 0.254: U1.6 35.8,23.3 35.22,23.88 35.22,28.32 34.84,28.7 27.09,28.7 26.84,28.45 U4.10
SS  (via drill 0.6)
  Top 0.254: U4.14 23.55,26.36 v22.85,25.65 | v15.74,25.91 R7.2 | U3.14 7.49,24.37 v8.24,23.87
  Bottom 0.254: v22.85,25.65 22.6,25.91 v15.74,25.91 14.34,24.51 8.88,24.51 v8.24,23.87
TXO  (via drill 0.6)
  Top 0.254: U4.31 26.79,19.1 v26.79,22.73
  Bottom 0.254: COMMS.2 30.65,26.59 v26.79,22.73
VCC
  Top 0.254: 25.57,11.05 25.82,10.79 U5.19 | 16.81,4.35 C11.A | C11.A 15.92,5.24 15.92,10.16 14.65,11.43 8.65,11.43 J1.VBUS | 25.57,11.05 25.57,6.22 23.37,4.02 C11.A | 25.57,11.05 25.57,12.28 C9.1 29.93,16.64 34.33,16.64 35.6,17.91 39.29,17.91 40.3,18.92 42.08,18.92 | U$2.40 62.4,49.78 61.64,49.02 61.64,41.91 61,41.27 59.5,41.27 U2.3 59.48,40.01 59.23,39.75 57.83,39.75 | U2.1 57.56,40.02 57.83,39.75 | 54.65,34.88 U$4.14 | U$1.19 42.21,15.12 42.21,18.8 42.08,18.92 | 42.08,18.92 42.21,19.05 42.21,25.53 42.58,25.9 U1.19 45.38,25.91 45.64,26.16 45.64,28.11 C10.2 50.08,28.19 51.61,29.72 51.61,34.16 52.37,34.92 U$4.14 | 57.83,39.75 57.48,39.41 C5.A 54.27,37.48 54.27,35.26 U$4.14
X0
  Top 0.254: U$2.27 62.27,14.86 62.27,7.11 60.88,5.71 U$5.4
X1  (via drill 0.6)
  Top 0.254: v57.32,8 U$5.6
  Bottom 0.254: U$2.28 62.27,17.4 62.27,9.02 61.26,8 v57.32,8
X2
  Top 0.254: U$2.29 61.77,19.43 61.77,7.37 60.75,6.35 U$5.5
X3  (via drill 0.6)
  Top 0.254: v58.97,15.62 57.13,15.62 U$7.4
  Bottom 0.254: U$2.30 61.77,21.97 61.77,16.26 61.13,15.62 v58.97,15.62
X4
  Top 0.254: U$2.31 62.27,25.02 62.27,20.83 61.26,19.81 61.26,11.56 60.61,10.91 U$6.4
X5  (via drill 0.6)
  Top 0.254: v58.84,17.27 57.83,16.26 U$7.5
  Bottom 0.254: U$2.32 61.26,26.54 61.26,17.65 60.88,17.27 v58.84,17.27
X6
  Top 0.254: U$2.33 61.77,29.59 61.77,21.08 60.75,20.07 60.75,12.19 60.11,11.56 U$6.5
X7  (via drill 0.6)
  Top 0.254: U$4.9 v57.86,33.56 | v55.91,30.59 U$4.3 U$4.2 55.26,25.3 v55.67,24.89 | v57.07,17.91 U$7.6
  Bottom 0.254: v55.67,24.89 55.67,19.3 v57.07,17.91 | U$2.34 63.19,33.56 v57.86,33.56 55.91,31.61 v55.91,30.59
Y0
  Top 0.254: U$1.18 44.24,13.58 44.24,17.53 48.56,21.84 U$2.12 50.97,21.84 51.62,22.49 U$8.1
Y1
  Top 0.254: U$1.17 44.37,11.18 44.87,11.56 44.87,17.27 46.91,19.3 U$2.13 50.72,19.3 51.22,19.81 51.22,21.08 51.99,21.84 U$8.2
Y2
  Top 0.254: U$1.16 45,9.91 45.51,10.54 45.51,15.37 47.03,16.76 U$2.14 50.84,16.76 51.99,17.91 51.99,20.57 52.61,21.19 U$8.3
Y3
  Top 0.254: U$2.15 46.78,14.22 46.27,13.72 46.27,9.27 45.64,8.64 U$1.15
Y4
  Top 0.254: U$1.14 45.89,7.37 47.03,8.51 47.03,11.05 47.67,11.68 U$2.16
Y5
  Top 0.254: U$2.17 45.89,6.1 U$1.13
Y6
  Top 0.254: U$1.12 47.16,4.83 U$2.18
Y7
  Top 0.254: U$2.19 45.38,4.06 44.37,3.05 U$1.11

### Text on the board
tPlace: COMMS | ISP | RST | SCK | MISO | RXI | TXO | GND | MOSI | 3.3
bPlace: USB Keyboard Adapter / For the Sinclair QL / (c) 2016 Petri Pellinen / https://github.com/ppe/QL_USB_Keyboard / v 1.0